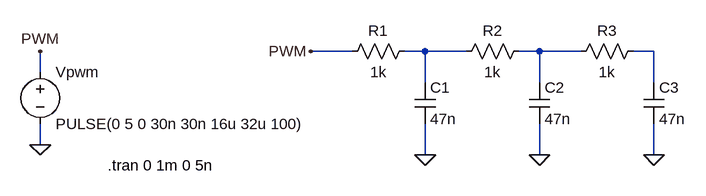
[diagram p0: schematic PWM.asc]
PWM.asc, the LTspice schematic file:
Version 4
SHEET 1 1076 680
WIRE 560 96 496 96
WIRE 672 96 640 96
WIRE 736 96 672 96
WIRE 848 96 816 96
WIRE 912 96 848 96
WIRE 1024 96 992 96
WIRE 80 128 80 96
WIRE 672 144 672 96
WIRE 848 144 848 96
WIRE 1024 144 1024 96
WIRE 80 240 80 208
WIRE 672 256 672 208
WIRE 848 256 848 208
WIRE 1024 256 1024 208
FLAG 80 240 0
FLAG 80 96 PWM
FLAG 672 256 0
FLAG 496 96 PWM
FLAG 848 256 0
FLAG 1024 256 0
SYMBOL voltage 80 112 R0
WINDOW 123 0 0 Left 2
WINDOW 39 0 0 Left 2
SYMATTR InstName Vpwm
SYMATTR Value PULSE(0 5 0 30n 30n 16u 32u 100)
SYMBOL res 656 80 R90
WINDOW 0 0 56 VBottom 2
WINDOW 3 32 56 VTop 2
SYMATTR InstName R1
SYMATTR Value 1k
SYMBOL cap 656 144 R0
SYMATTR InstName C1
SYMATTR Value 47n
SYMBOL res 832 80 R90
WINDOW 0 0 56 VBottom 2
WINDOW 3 32 56 VTop 2
SYMATTR InstName R2
SYMATTR Value 1k
SYMBOL cap 832 144 R0
SYMATTR InstName C2
SYMATTR Value 47n
SYMBOL res 1008 80 R90
WINDOW 0 0 56 VBottom 2
WINDOW 3 32 56 VTop 2
SYMATTR InstName R3
SYMATTR Value 1k
SYMBOL cap 1008 144 R0
SYMATTR InstName C3
SYMATTR Value 47n
TEXT 184 272 Left 2 !.tran 0 1m 0 5n

The netlist it stands for:
* PWM.asc
Vpwm PWM 0 PULSE(0 5 0 30n 30n 16u 32u 100)
R1 N001 PWM 1k
C1 N001 0 47n
R2 N002 N001 1k
C2 N002 0 47n
R3 N003 N002 1k
C3 N003 0 47n
.tran 0 1m 0 5n
.backanno
.end